# EAGLE design 27C128_adapter (EAGLE 6.5.0)
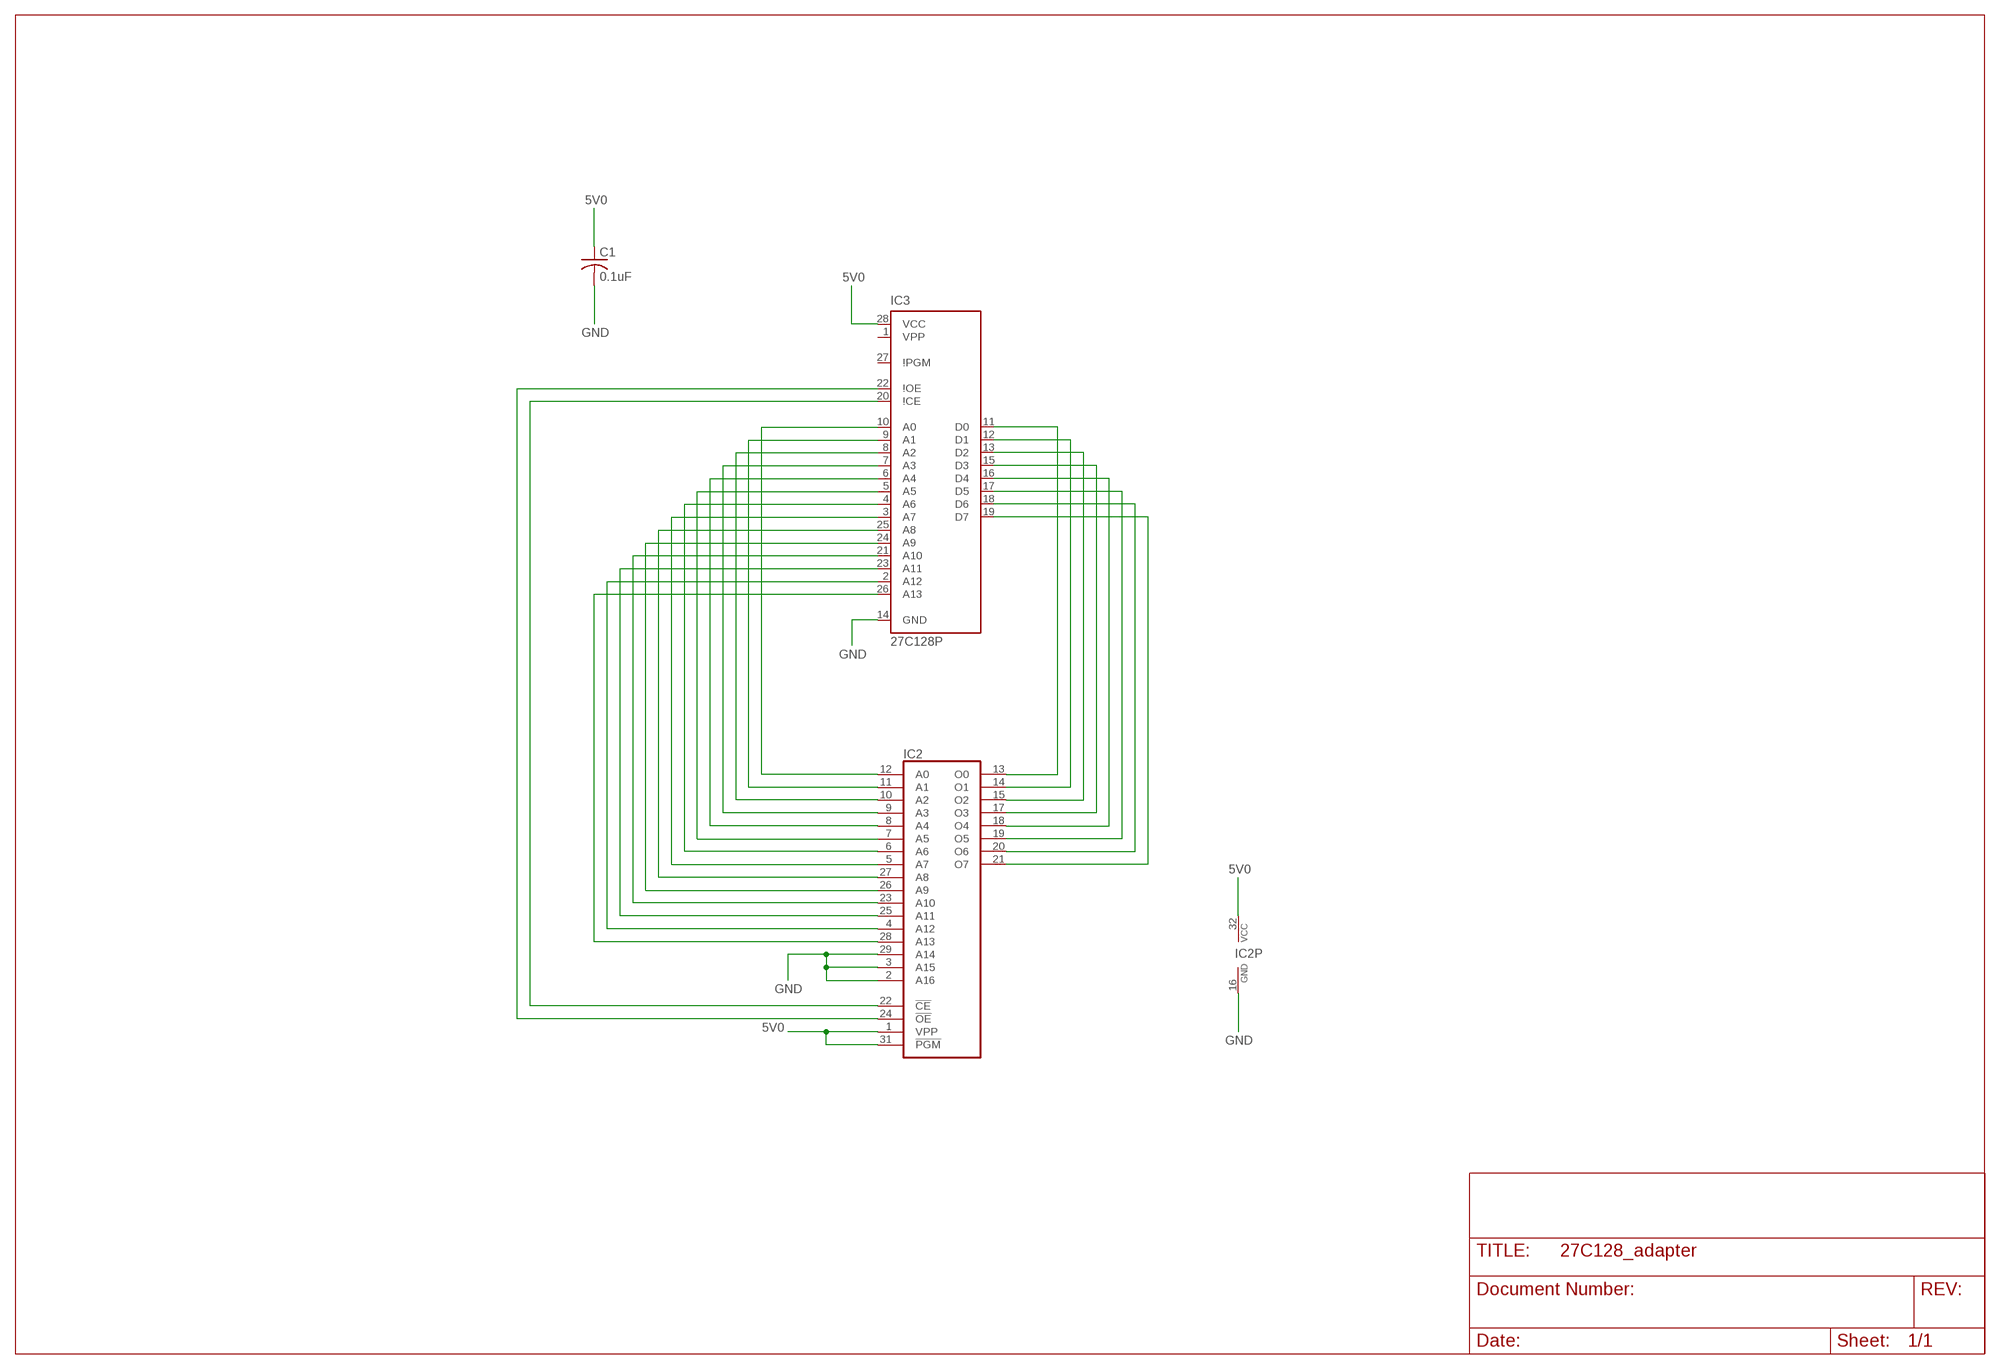
[diagram p0: schematic, sheet 1]

## Parts
C1  0.1uF  C-USC0603K  [C0603K]
IC2  27010PLCC32  [PLCC32R]
IC3  27C128P  [DIL28-6]

## Nets
5V0: C1.1 IC2.1(VPP) IC2.31(!PGM) IC2.32(VCC) IC3.28(VCC)
GND: C1.2 IC2.2(A16) IC2.3(A15) IC2.16(GND) IC2.29(A14) IC3.14(GND)
N$1: IC2.25(A11) IC3.23(A11)
N$2: IC2.4(A12) IC3.2(A12)
N$3: IC2.28(A13) IC3.26(A13)
N$4: IC2.17(O3) IC3.15(D3)
N$5: IC2.18(O4) IC3.16(D4)
N$6: IC2.19(O5) IC3.17(D5)
N$7: IC2.20(O6) IC3.18(D6)
N$8: IC2.21(O7) IC3.19(D7)
N$9: IC2.12(A0) IC3.10(A0)
N$10: IC2.11(A1) IC3.9(A1)
N$11: IC2.14(O1) IC3.12(D1)
N$12: IC2.13(O0) IC3.11(D0)
N$13: IC2.15(O2) IC3.13(D2)
N$20: IC2.22(!CE) IC3.20(\!CE)
N$21: IC2.24(!OE) IC3.22(\!OE)
N$22: IC2.10(A2) IC3.8(A2)
N$23: IC2.9(A3) IC3.7(A3)
N$24: IC2.8(A4) IC3.6(A4)
N$25: IC2.7(A5) IC3.5(A5)
N$26: IC2.6(A6) IC3.4(A6)
N$27: IC2.5(A7) IC3.3(A7)
N$28: IC2.27(A8) IC3.25(A8)
N$29: IC2.26(A9) IC3.24(A9)
N$30: IC2.23(A10) IC3.21(A10)
Unconnected: IC3.1(VPP) IC3.27(\!PGM)

## Library data of the parts
C1 = rcl:C-US: CAPACITOR, American symbol
IC2 = memory-joe:27010: MEMORY
IC3 = microchip-update-2:27*128: CMOS EPROM 128 K (16 K x 8)

## Board
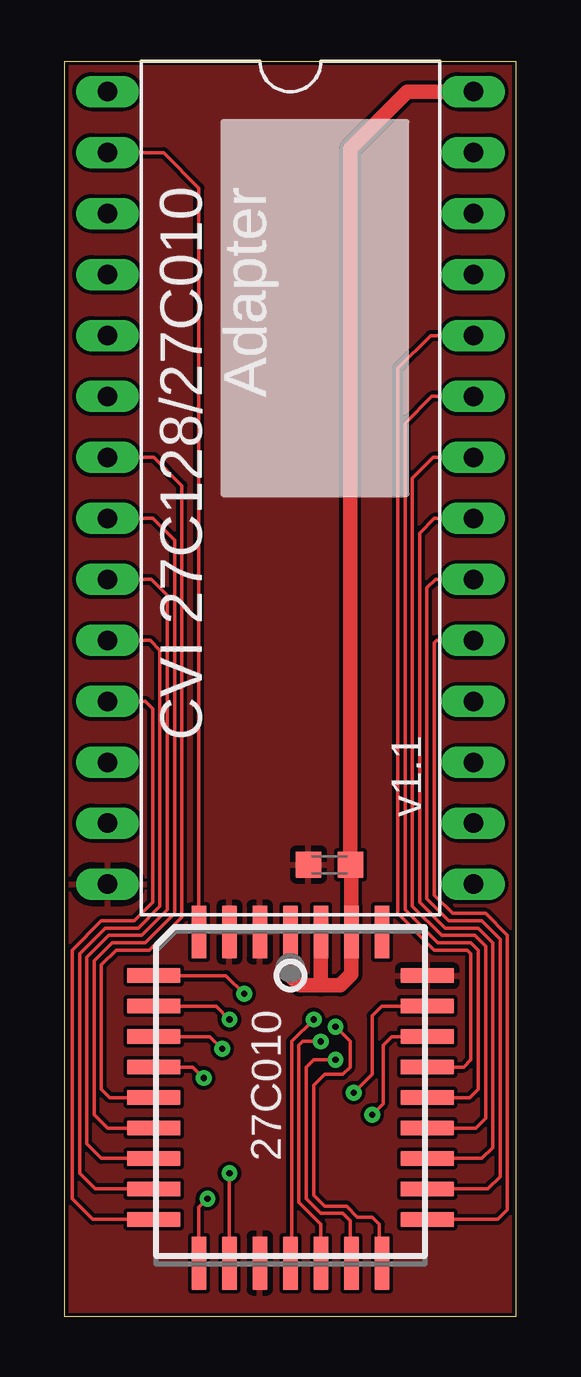
[diagram p1: board, top side]
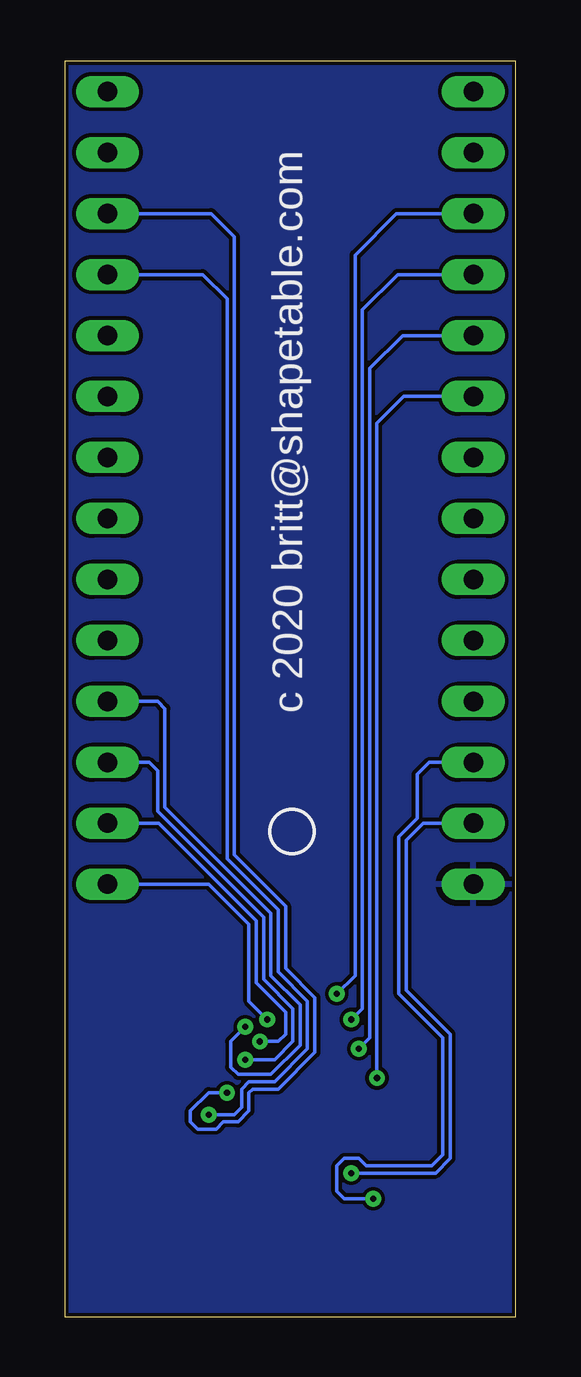
[diagram p2: board, bottom side, seen from below]

Size 18.8 x 52.32 mm. Coordinates in mm from the lower left corner, seen from the top.
Outline: 0,0 0,52.32 18.8,52.32 18.8,0 0,0
Copper layers (1*16): Top 0.035mm / dielectric 1.5mm / Bottom 0.035mm
Design rules "default *": minimum track width 6mil, minimum drill 10mil, track to track 6mil, track to pad 6mil, pad to pad 6mil, via to via 6mil, smd to smd 6mil, copper to edge 6mil, drill to drill 6mil, minimum pad ring 10mil, minimum via ring 8mil, stop-mask expansion 4mil, vias tented up to drill 10mil, thermal gap 10mil

### Footprints (pad centres in the part's own frame; a part is rotated, then mirrored left to right if it is on the bottom)
C0603K = smd 1.05 x 1.08: 1 -0.875,0; 2 0.875,0
PLCC32R = smd 0.6 x 2.2: 1 0,6.9; 2 -1.27,6.9; 3 -2.54,6.9; 4 -3.81,6.9; 14 -3.81,-6.9; 15 -2.54,-6.9; 16 -1.27,-6.9; 17 0,-6.9; 18 1.27,-6.9; 19 2.54,-6.9; 20 3.81,-6.9; 30 3.81,6.9; 31 2.54,6.9; 32 1.27,6.9 | smd 2.2 x 0.6: 5 -5.7,5.08; 6 -5.7,3.81; 7 -5.7,2.54; 8 -5.7,1.27; 9 -5.7,0; 10 -5.7,-1.27; 11 -5.7,-2.54; 12 -5.7,-3.81; 13 -5.7,-5.08; 21 5.7,-5.08; 22 5.7,-3.81; 23 5.7,-2.54; 24 5.7,-1.27; 25 5.7,0; 26 5.7,1.27; 27 5.7,2.54; 28 5.7,3.81; 29 5.7,5.08
DIL28-6 = drill 0.813 long: 1 -16.51,-7.62; 2 -13.97,-7.62; 3 -11.43,-7.62; 4 -8.89,-7.62; 5 -6.35,-7.62; 6 -3.81,-7.62; 7 -1.27,-7.62; 8 1.27,-7.62; 9 3.81,-7.62; 10 6.35,-7.62; 11 8.89,-7.62; 12 11.43,-7.62; 13 13.97,-7.62; 14 16.51,-7.62; 15 16.51,7.62; 16 13.97,7.62; 17 11.43,7.62; 18 8.89,7.62; 19 6.35,7.62; 20 3.81,7.62; 21 1.27,7.62; 22 -1.27,7.62; 23 -3.81,7.62; 24 -6.35,7.62; 25 -8.89,7.62; 26 -11.43,7.62; 27 -13.97,7.62; 28 -16.51,7.62

### Placement (x,y rotation side)
C1  11.02,18.85 180 top
IC2  9.4,9.14 0 top
IC3  9.4,34.54 270 top

### Tracks (layer width: path | path; a pad name or v marks a point on that pad's centre or on a via)
5V0
  Top 0.61: 10.67,13.82 11.48,13.82 11.94,14.28 IC2.31 11.94,18.66 C1.1 11.9,48.68 14.28,51.05 IC3.28 | 10.67,13.82 9.8,13.82 9.4,14.22 IC2.1 | IC2.32 10.67,13.82
GND
  pour Bottom (isolate 0.152): -0.51,-0.51 -0.51,52.83 19.3,52.83 19.3,-0.51
  pour Top (isolate 0.152): -0.51,-0.51 -0.51,52.83 19.3,52.83 19.3,-0.51
N$1
  Top 0.152: IC2.25 16.87,9.14 17.22,9.5 17.22,15.29 16.92,15.6 15.54,15.6 14.17,16.97 14.17,37.24 15.29,38.35 IC3.23
N$2
  Top 0.152: IC2.4 5.59,47.04 4.12,48.51 IC3.2
N$3  (via drill 0.25)
  Top 0.152: IC2.28 13.21,12.95 12.8,12.55 12.8,10.11 v12.04,9.35
  Bottom 0.152: IC3.26 12.7,45.97 11.73,45.01 11.73,19.25 9.6,17.12 9.6,14.53 8.38,13.31 8.38,11.02 9.91,9.5 10.97,9.5 11.12,9.35 11.12,8.59 11.58,8.13 12.19,8.13 12.5,7.82 13.26,7.82 13.56,8.13 13.56,8.59 12.8,9.35 v12.04,9.35
N$4  (via drill 0.25)
  Top 0.152: IC2.17 9.45,2.3 9.45,11.48 v10.36,12.4
  Bottom 0.152: v10.36,12.4 11.12,13.16 11.12,16.36 12.8,18.03 IC3.15
N$5  (via drill 0.25)
  Top 0.152: IC2.18 10.67,3.86 9.75,4.78 9.75,11.33 9.91,11.48 v10.67,11.48
  Bottom 0.152: v10.67,11.48 9.91,11.48 9.6,11.79 9.6,12.7 10.82,13.92 10.82,16.51 14.88,20.57 IC3.16
N$6  (via drill 0.25)
  Top 0.152: IC2.19 11.89,2.3 11.89,4.01 11.58,4.32 10.67,4.32 10.06,4.93 10.06,10.41 10.36,10.72 v11.28,10.72
  Bottom 0.152: v11.28,10.72 10.06,10.72 9.3,11.48 9.3,12.85 10.52,14.07 10.52,16.66 14.93,21.08 14.93,22.76 15.29,23.11 IC3.17
N$7  (via drill 0.25)
  Top 0.152: IC2.20 13.11,2.35 13.11,3.86 12.8,4.17 12.19,4.17 11.73,4.62 10.82,4.62 10.36,5.08 10.36,9.65 10.82,10.11 11.58,10.11 11.89,10.41 11.89,11.48 v11.28,12.09
  Bottom 0.152: v11.28,12.09 11.89,11.48 11.89,10.41 11.58,10.11 10.21,10.11 8.99,11.33 8.99,13.01 10.21,14.22 10.21,16.82 14.63,21.23 14.63,25.35 14.93,25.65 IC3.18
N$8
  Top 0.152: IC2.21 18.03,4.06 18.44,4.47 18.44,15.9 17.53,16.82 16.15,16.82 15.39,17.58 15.39,28.09 15.49,28.19 IC3.19
N$9
  Top 0.152: IC2.12 1.27,5.33 0.61,5.99 0.61,15.14 1.68,16.21 3.05,16.21 3.96,17.12 3.96,27.79 3.56,28.19 IC3.10
N$10
  Top 0.152: IC2.11 1.52,6.6 0.91,7.21 0.91,14.99 1.83,15.9 3.2,15.9 4.27,16.97 4.27,30.07 3.61,30.73 IC3.9
N$11  (via drill 0.25)
  Top 0.152: IC2.14 5.59,4.57 v5.94,4.93
  Bottom 0.152: v5.94,4.93 7.16,4.93 7.47,5.23 7.47,6.3 7.16,6.6 6.55,6.6 6.25,6.3 3.51,6.3 3.05,6.76 3.05,11.63 4.88,13.46 4.88,20.02 4.12,20.78 4.12,22.61 3.61,23.11 IC3.12
N$12
  Top 0.152: IC2.13 1.17,4.06 0.3,4.93 0.3,15.29 1.52,16.51 2.9,16.51 3.66,17.27 3.66,25.35 3.35,25.65 IC3.11
N$13  (via drill 0.25)
  Top 0.152: IC2.15 v6.86,5.99
  Bottom 0.152: v6.86,5.99 3.35,5.99 2.74,6.6 2.74,11.79 4.57,13.61 4.57,19.86 3.86,20.57 IC3.13
N$20
  Top 0.152: IC2.22 17.63,5.33 18.14,5.84 18.14,15.75 17.37,16.51 16,16.51 15.09,17.42 15.09,30.38 15.44,30.73 IC3.20
N$21
  Top 0.152: IC2.24 17.12,7.87 17.53,8.28 17.53,15.44 17.07,15.9 15.7,15.9 14.48,17.12 14.48,34.95 15.34,35.81 IC3.22
N$22
  Top 0.152: IC2.10 1.78,7.87 1.22,8.43 1.22,14.83 1.98,15.6 3.35,15.6 4.57,16.82 4.57,32.36 3.66,33.27 IC3.8
N$23
  Top 0.152: IC2.9 1.88,9.14 1.52,9.5 1.52,14.68 2.13,15.29 3.51,15.29 4.88,16.66 4.88,34.65 3.71,35.81 IC3.7
N$24  (via drill 0.25)
  Top 0.152: IC2.8 5.33,10.41 v5.79,9.96
  Bottom 0.152: v5.79,9.96 5.79,37.24 4.67,38.35 IC3.6
N$25  (via drill 0.25)
  Top 0.152: IC2.7 6.04,11.68 v6.55,11.18
  Bottom 0.152: v6.55,11.18 6.1,11.63 6.1,39.52 4.72,40.89 IC3.5
N$26  (via drill 0.25)
  Top 0.152: IC2.6 6.3,12.95 v6.86,12.4
  Bottom 0.152: v6.86,12.4 6.4,12.85 6.4,41.96 4.93,43.43 IC3.4
N$27  (via drill 0.25)
  Top 0.152: IC2.5 6.71,14.22 v7.47,13.46
  Bottom 0.152: v7.47,13.46 6.71,14.22 6.71,44.25 4.98,45.97 IC3.3
N$28  (via drill 0.25)
  Top 0.152: IC2.27 13.61,11.68 13.26,11.33 13.26,8.89 v12.8,8.43
  Bottom 0.152: v12.8,8.43 11.73,8.43 11.43,8.74 11.43,9.5 11.12,9.8 10.06,9.8 8.69,11.18 8.69,13.16 9.91,14.38 9.91,16.97 12.04,19.1 12.04,42.42 13.06,43.43 IC3.25
N$29
  Top 0.152: IC2.26 16.61,10.41 16.92,10.72 16.92,15.14 16.76,15.29 15.39,15.29 13.87,16.82 13.87,39.52 15.24,40.89 IC3.24
N$30
  Top 0.152: IC2.23 17.37,6.6 17.83,7.06 17.83,15.6 17.22,16.21 15.85,16.21 14.78,17.27 14.78,32.66 15.39,33.27 IC3.21

### Text on the board
tPlace: CVI 27C128/27C010 / Adapter | v1.1 | 27C010
bPlace: c 2020 britt@shapetable.com